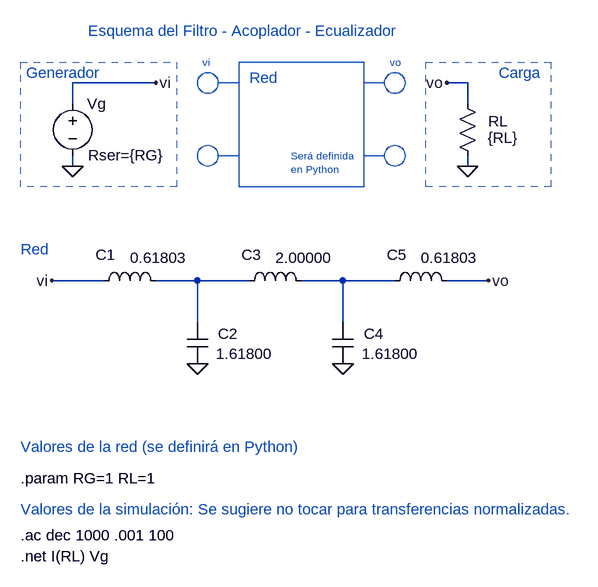
[diagram p0: schematic pyltspice_ecualizador_butter_orden_5_ripple_3dB_r01_1_r02_1.asc]
pyltspice_ecualizador_butter_orden_5_ripple_3dB_r01_1_r02_1.asc, the LTspice schematic file:
Version 4
SHEET 1 916 680
WIRE 160 -304 32 -304
WIRE 640 -304 608 -304
WIRE 32 -272 32 -304
WIRE 640 -272 640 -304
WIRE 32 -176 32 -192
WIRE 640 -176 640 -192
FLAG 32 -176 0
FLAG 640 -176 0
FLAG 160 -304 vi
FLAG 608 -304 vo
SYMBOL voltage 32 -288 R0
WINDOW 3 34 121 Invisible 2
WINDOW 39 24 95 Left 2
WINDOW 0 22 16 Left 2
SYMATTR Value 0
SYMATTR SpiceLine Rser={RG}
SYMATTR InstName Vg
SYMATTR Value2 AC 1 0
SYMBOL res 624 -288 R0
WINDOW 0 48 43 Left 2
WINDOW 3 47 68 Left 2
SYMATTR InstName RL
SYMATTR Value {RL}
TEXT -48 424 Left 2 !.net I(RL) Vg
TEXT -48 392 Left 2 !.ac dec 1000 .001 100
TEXT 304 -312 Left 2 ;Red
TEXT -40 -320 Left 2 ;Generador
TEXT 688 -320 Left 2 ;Carga
TEXT 368 -192 Left 1 ;Será definida \nen Python
TEXT -48 256 Left 2 ;Valores de la red (se definirá en Python)
TEXT 56 -384 Left 2 ;Esquema del Filtro - Acoplador - Ecualizador
TEXT -48 352 Left 2 ;Valores de la simulación: Se sugiere no tocar para transferencias normalizadas.
TEXT -48 -48 Left 2 ;Red
TEXT 232 -336 Left 1 ;vi
TEXT 520 -336 Left 1 ;vo
LINE Normal 288 -304 256 -304
LINE Normal 288 -192 256 -192
LINE Normal 480 -192 512 -192
LINE Normal 480 -304 512 -304
RECTANGLE Normal 480 -144 288 -336
RECTANGLE Normal 768 -144 576 -336 2
RECTANGLE Normal 192 -144 -48 -336 2
CIRCLE Normal 256 -288 224 -320
CIRCLE Normal 256 -176 224 -208
CIRCLE Normal 512 -208 544 -176
CIRCLE Normal 512 -320 544 -288
FLAG 0 0 vi
WIRE 0 0 80 0
WIRE 160 0 224 0
SYMBOL ind 64 16 R270
WINDOW 0 40 19 VTop 2
WINDOW 3 67 100 VBottom 2
SYMATTR InstName C1
SYMATTR Value 0.61803
WIRE 224 0 224 64
SYMBOL cap 208 64 R0
WINDOW 0 48 18 Left 2
WINDOW 3 45 49 Left 2
SYMATTR InstName C2
SYMATTR Value 1.61800
FLAG 224 128 0
WIRE 224 0 304 0
WIRE 384 0 448 0
SYMBOL ind 288 16 R270
WINDOW 0 40 19 VTop 2
WINDOW 3 67 100 VBottom 2
SYMATTR InstName C3
SYMATTR Value 2.00000
WIRE 448 0 448 64
SYMBOL cap 432 64 R0
WINDOW 0 48 18 Left 2
WINDOW 3 45 49 Left 2
SYMATTR InstName C4
SYMATTR Value 1.61800
FLAG 448 128 0
WIRE 448 0 528 0
WIRE 608 0 672 0
SYMBOL ind 512 16 R270
WINDOW 0 40 19 VTop 2
WINDOW 3 67 100 VBottom 2
SYMATTR InstName C5
SYMATTR Value 0.61803
FLAG 672 0 vo
TEXT -48 304 Left 2 !.param RG=1 RL=1

The netlist it stands for:
* pyltspice_ecualizador_butter_orden_5_ripple_3dB_r01_1_r02_1.asc
Vg vi 0 0 AC 1 0 Rser={RG}
RL vo 0 {RL}
L§C1 vi N001 0.61803
C2 N001 0 1.61800
L§C3 N001 N002 2.00000
C4 N002 0 1.61800
L§C5 N002 vo 0.61803
.net I(RL) Vg
.ac dec 1000 .001 100
* Red
* Generador
* Carga
* Será definida
* en Python
* Valores de la red (se definirá en Python)
* Esquema del Filtro - Acoplador - Ecualizador
* Valores de la simulación: Se sugiere no tocar para transferencias normalizadas.
* Red
* vi
* vo
.param RG=1 RL=1
.backanno
.end

* Results of the author's LTspice run, read from the files saved beside the schematic
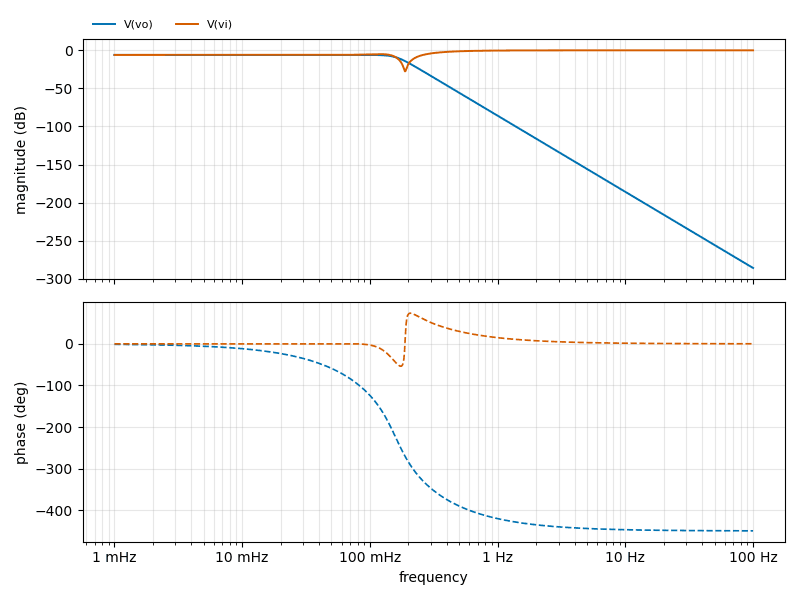
[diagram p1: AC Analysis of pyltspice_ecualizador_butter_orden_5_ripple_3dB_r01_1_r02_1.asc, plotted from the saved traces]
* AC Analysis, 1 run:
*   V(vo): -6.03 dB at 1 mHz, -285.84 dB at 100 Hz, peak -6.03 dB at 1 mHz, 3 dB below the peak at 159.1 mHz
*   V(vi): -6.01 dB at 1 mHz, -0.00 dB at 100 Hz, peak -0.00 dB at 100 Hz, 3 dB below the peak at 338.6 mHz